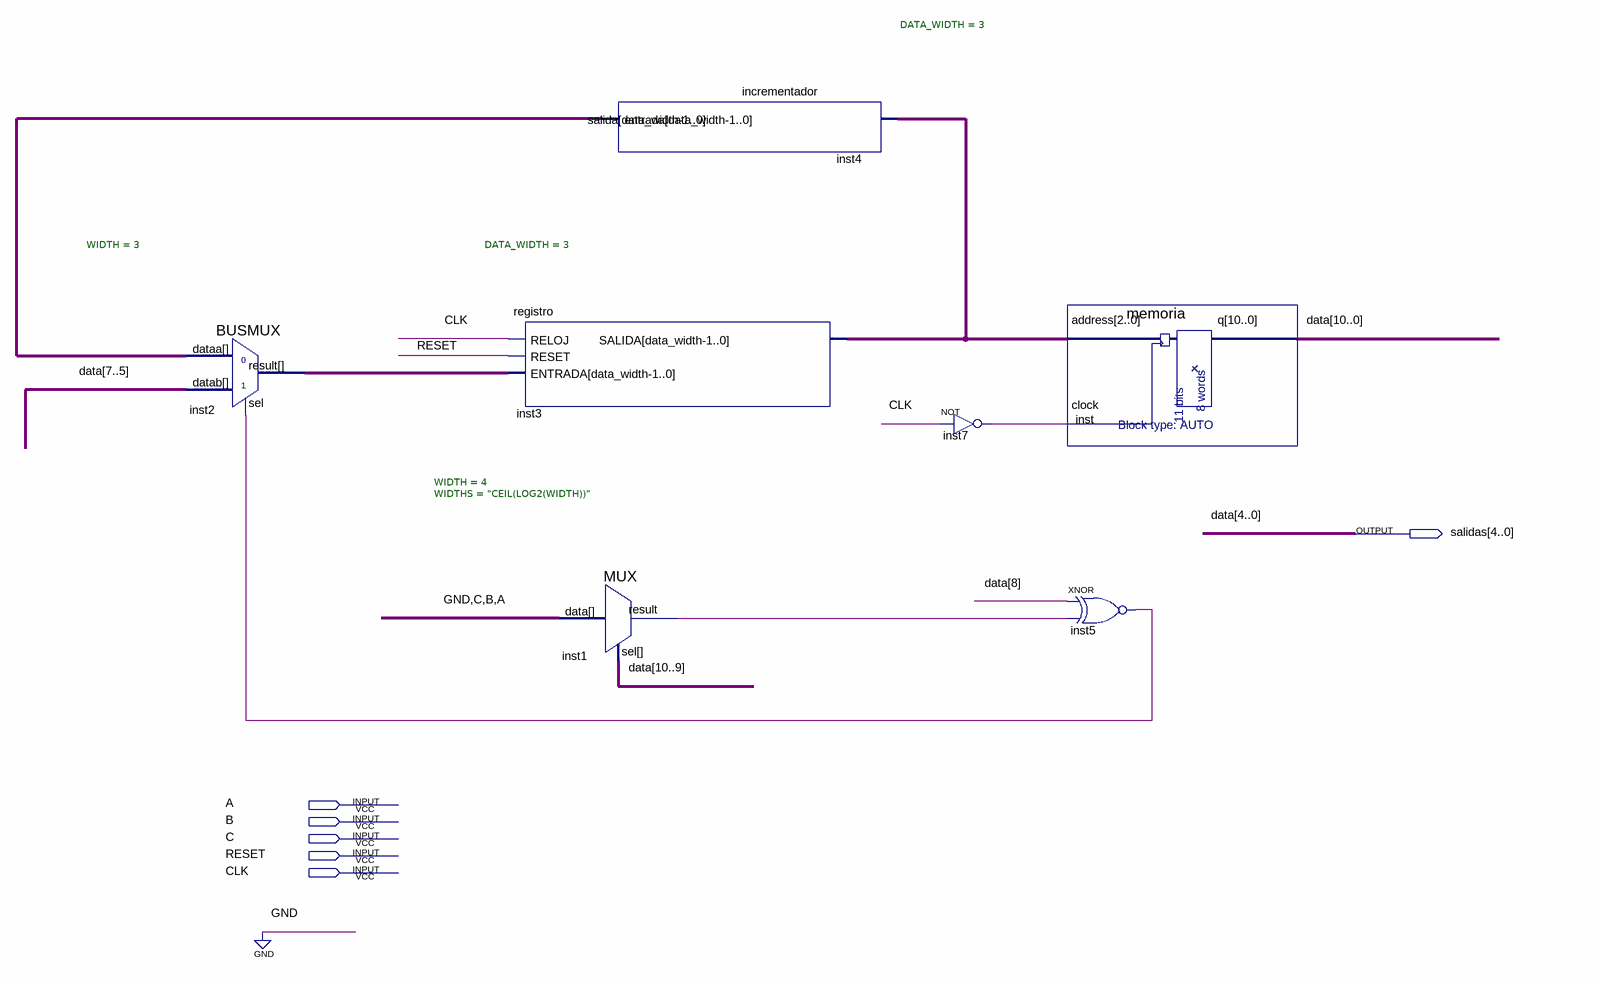
[diagram p0: schematic sheet]
// Quartus schematic cinco.bdf as structural Verilog: 7 symbols, 6 pins
module cinco (
  input  A,
  input  B,
  input  C,
  input  RESET,
  input  CLK,
  output [4:0] salidas
);

  wire inst1_result, inst5_out, inst7_out;
  wire [2:0] inst2_result, inst3_salida, inst4_salida;
  wire [10:5] data;

  BUSMUX #(.WIDTH(3)) inst2 (.datab(data[7:5]), .sel(inst5_out), .dataa(inst4_salida), .result(inst2_result));
  registro #(.DATA_WIDTH(3)) inst3 (.RELOJ(CLK), .RESET(RESET), .ENTRADA(inst2_result), .SALIDA(inst3_salida));
  incrementador #(.DATA_WIDTH(3)) inst4 (.entrada(inst3_salida), .salida(inst4_salida));
  MUX #(.WIDTH(4), .WIDTHS("CEIL(LOG2(WIDTH))")) inst1 (
    .data({1'b0, C, B, A}), .sel(data[10:9]), .result(inst1_result));
  not inst7 (inst7_out, CLK);
  memoria inst (.address(inst3_salida), .clock(inst7_out), .q({data, salidas}));
  xnor inst5 (inst5_out, data[8], inst1_result);

  // Other names for the same wires on the sheet: data[4:0] = salidas
endmodule
